# Altium schematic sheet ZH_ZP.SchDoc
size Tabloid
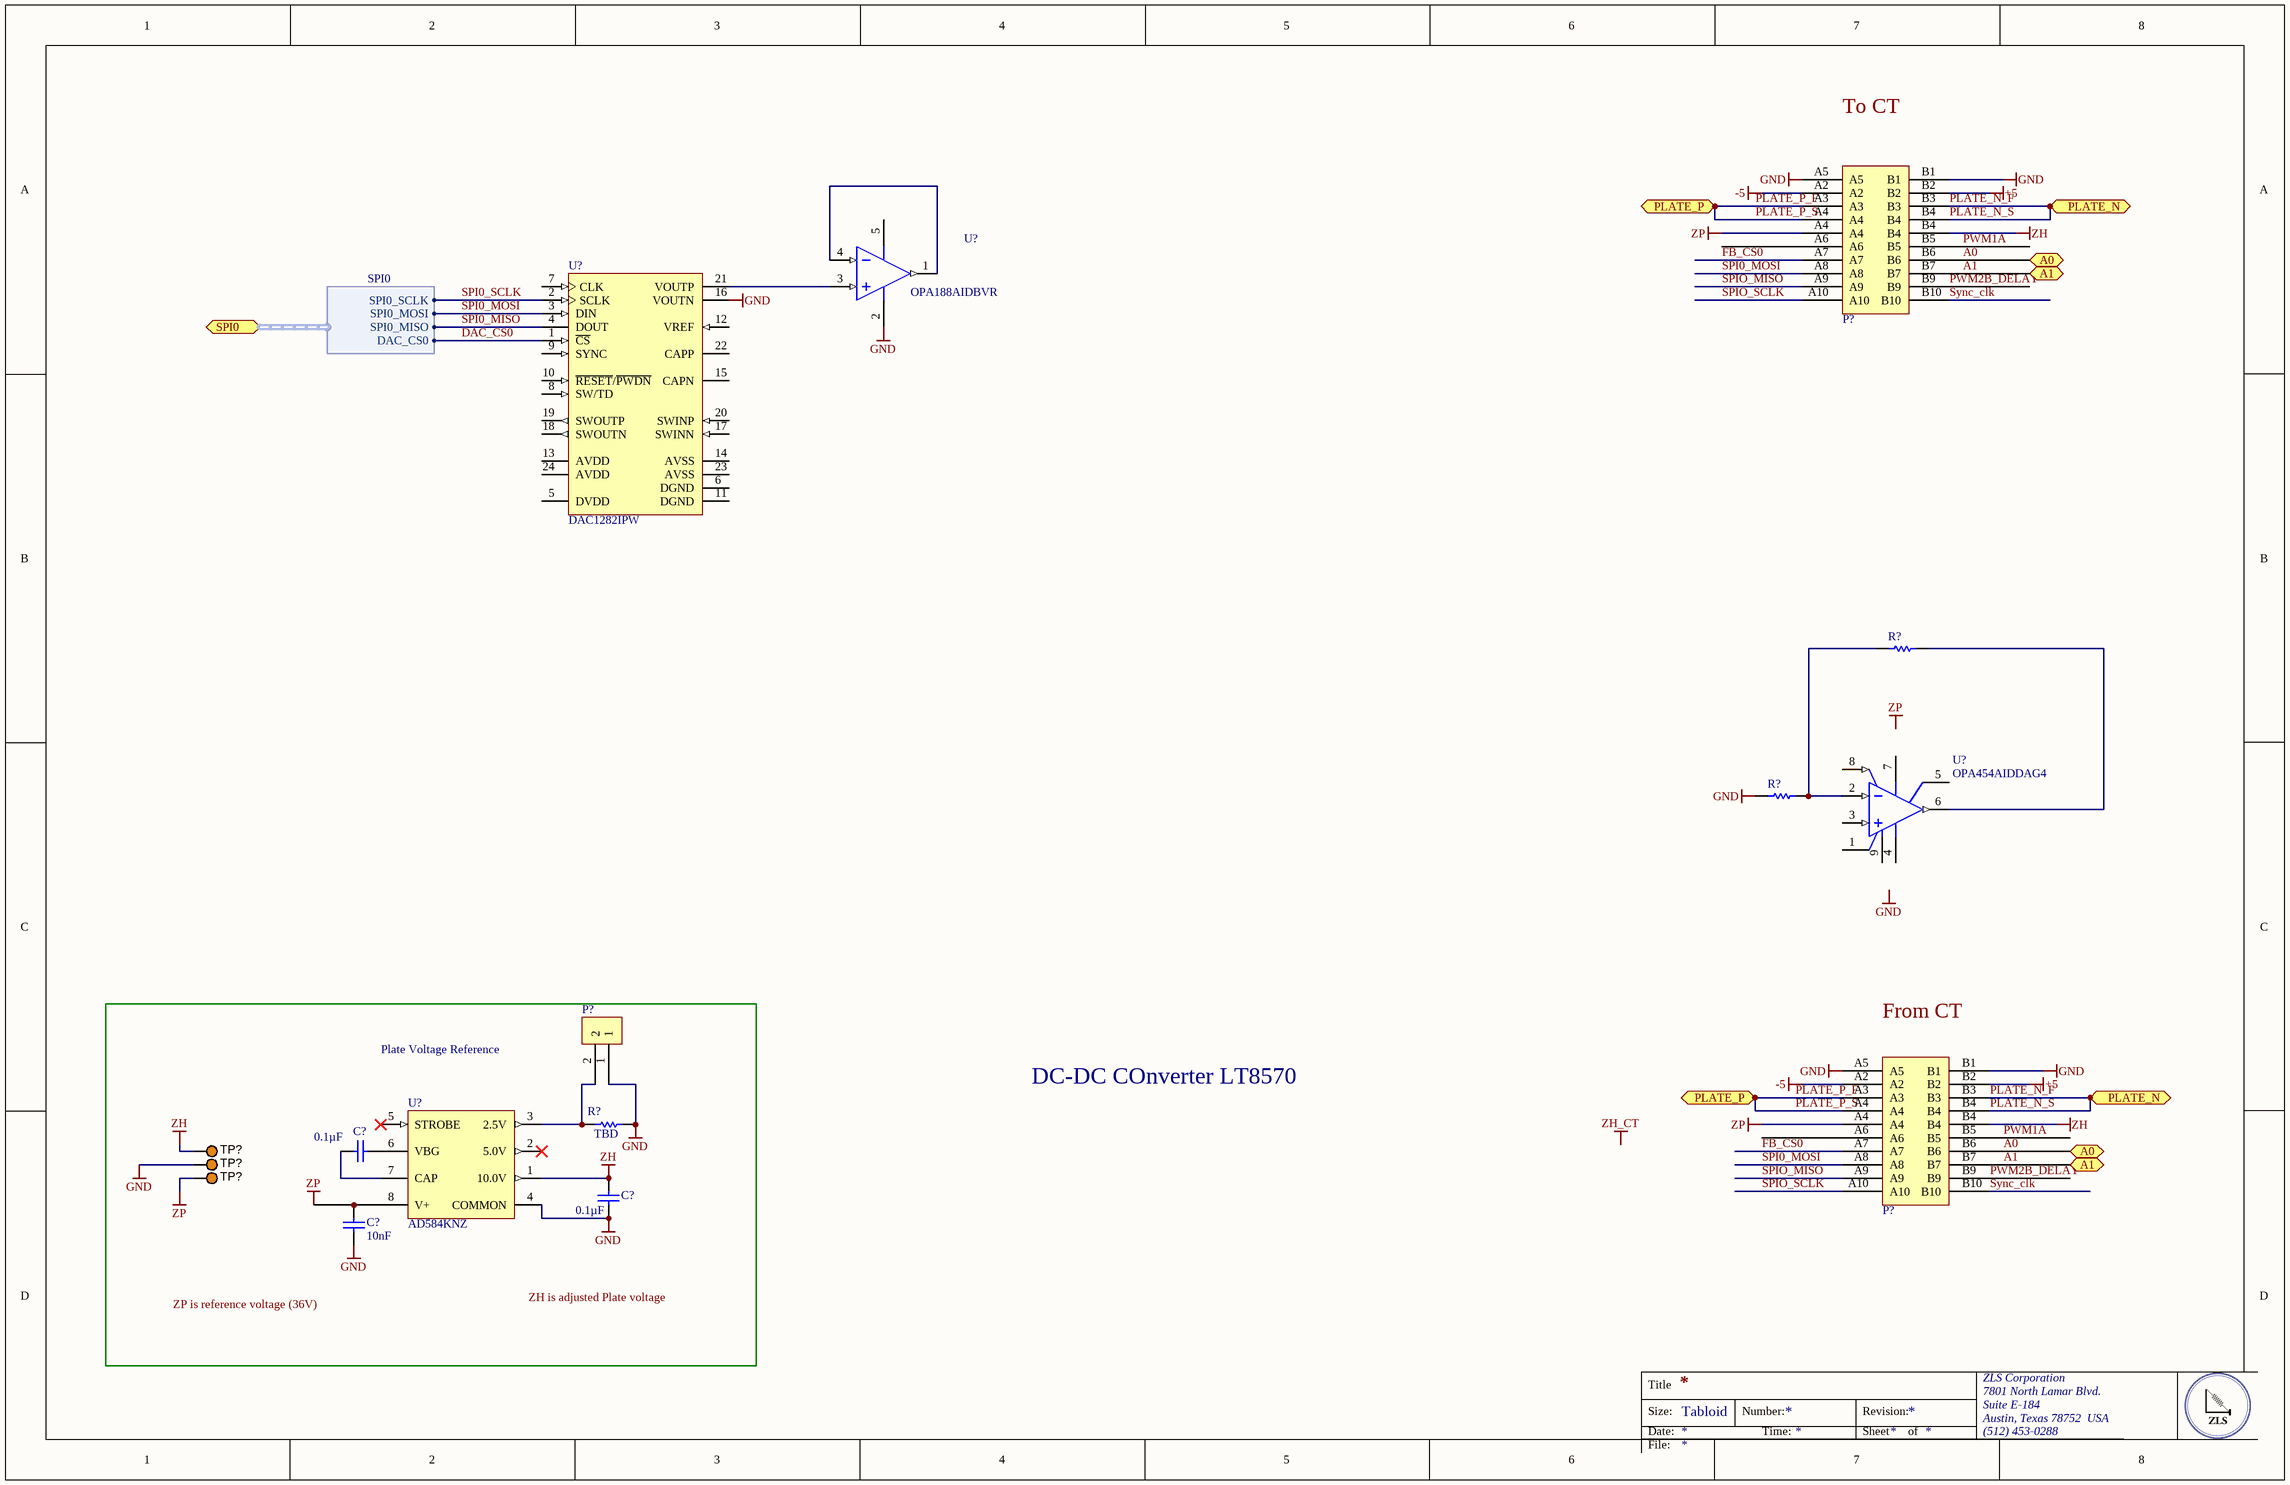
[diagram p0: ZH_ZP.SchDoc]

## Parts
(Parts that share a designator on the sheet are numbered #1, #2 ... from top to bottom, then left to right.)
C?#1  Capacitance: 0.1µF  [CAPC0805(2012)145_N]  (hidden comment: CAP CER 0.1UF 25V X7R 0805)
C?#2  Capacitance: 0.1µF  [CAPC0805(2012)145_N]  (hidden comment: CAP CER 0.1UF 25V X7R 0805)
C?#3  Capacitance: 10nF  [CAPC0805(2012)145_N]  (hidden comment: Multilayer Ceramic Capacitors MLCC - SMD/SMT 0.01uF 50volts 10% X7R)
P?#1  MEC6-110-0-PCB  [MEC6-110-02-L-DV]  (value not drawn)
P?#2  MEC6-110-0-PCB  [MEC6-110-02-L-DV]  (value not drawn)
P?#3  SSW-102-02-G-S-RA  [SSW-102-02-G-S-RA]  (value not drawn)
R?#1  (no value)  [RESC0402(1005)_M]
R?#2  (no value)  [RESC0402(1005)_M]
R?#3  TBD  [VH102K]
TP?#1  5003  [KSTN-5003]  (value not drawn)
TP?#2  5003  [KSTN-5003]  (value not drawn)
TP?#3  5003  [KSTN-5003]  (value not drawn)
U?#1  OPA188AIDBVR  [DBV0005A_M]
U?#2  DAC1282IPW  [TI-PW24_M]
U?#3  OPA454AIDDAG4  [TI-DDA8-2745X2245TP_N]
U?#4  AD584KNZ  [ADI-N-8]

## Blocks framed on the sheet
Plate Voltage Reference: C?#1-C?#3 P?#3 R?#3 TP?#1-TP?#3 U?#4

## Ports
A0, A1, PLATE_N, PLATE_P, SPI0 (harness SPI0)

## Harnesses
SPI0: DAC_CS0, SPI0_MOSI, SPI0_MISO, SPI0_SCLK

## Nets
+5: P?#1.B2 P?#2.B2
-5: P?#1.A2 P?#2.A2
GND: C?#2.2 C?#3.2 P?#1.A5 P?#1.B1 P?#2.A5 P?#2.B1 P?#3.1 R?#2.2 R?#3.2 TP?#2.1 U?#1.2(V-) U?#2.16(VOUTN) U?#4.4(COMMON)
ZH: C?#2.1 P?#1.B4 P?#2.B4 TP?#1.1 U?#4.1(10.0V)
ZP: C?#3.1 P?#1.A4 P?#2.A4 TP?#3.1 U?#4.8(V+)
A0: P?#1.B6 P?#2.B6 ; port A0
A1: P?#1.B7 P?#2.B7 ; port A1
DAC_CS0: U?#2.1(~{CS}) ; port SPI0.DAC_CS0
FB_CS0: P?#1.A7 P?#2.A7
PLATE_N_F: P?#1.B3 P?#1.B4 P?#2.B3 P?#2.B4 ; port PLATE_N  [also labelled PLATE_N_S]
PLATE_P_F: P?#1.A3 P?#1.A4 P?#2.A3 P?#2.A4 ; port PLATE_P  [also labelled PLATE_P_S]
PWM1A: P?#1.B5 P?#2.B5
PWM2B_DELAY: P?#1.B9 P?#2.B9
SPI0_MISO: U?#2.4(DOUT) ; port SPI0.SPI0_MISO
SPI0_MOSI: P?#1.A8 P?#2.A8 U?#2.3(DIN) ; port SPI0.SPI0_MOSI
SPI0_SCLK: U?#2.2(SCLK) ; port SPI0.SPI0_SCLK
SPIO_MISO: P?#1.A9 P?#2.A9
SPIO_SCLK: P?#1.A10 P?#2.A10
Sync_clk: P?#1.B10 P?#2.B10
NetC?#1_1: C?#1.1 U?#4.7(CAP)
NetC?#1_2: C?#1.2 U?#4.6(VBG)
NetP?#3_2: P?#3.2 R?#3.1 U?#4.3(2.5V)
NetR?#1_1: R?#1.1 U?#3.6(OUT)
NetR?#1_2: R?#1.2 R?#2.1 U?#3.2(IN-)
NetU?#1_1: U?#1.1(OUT) U?#1.4(IN-)
NetU?#1_3: U?#1.3(IN+) U?#2.21(VOUTP)

Not connected (* = marked no-connect by the designer): P?#1 A6; P?#2 A6; U?#1 5(V+); U?#2 5(DVDD) 6(DGND) 7(CLK) 8(SW/TD) 9(SYNC) 10(~{RESET}/~{PWDN}) 11(DGND) 12(VREF) 13(AVDD) 14(AVSS) 15(CAPN) 17(SWINN) 18(SWOUTN) 19(SWOUTP) 20(SWINP) 22(CAPP) 23(AVSS) 24(AVDD); U?#3 1(E/D_COM) 3(IN+) 4(V-) 5(STATUS_FLAG) 7(V+) 8(E/D) 9(EP); U?#4 2(5.0V)* 5(STROBE)*

## Notes on the sheet
- To CT
- (near P?#2) From CT
- DC-DC COnverter LT8570
- Labels drawn without touching a wire or pin: GND, ZH is adjusted Plate voltage, ZH_CT, ZP, ZP is reference voltage (36V)
- Title
- Size:
- Date:
- Tabloid
- Number:
- Time:
- Revision:
- Sheet
- of
- ZLS Corporation
- 7801 North Lamar Blvd.
- Suite E-184
- Austin, Texas 78752  USA
- (512) 453-0288
- File:

## Library data of the parts
C?#1 C?#2 = CMP-1036-04795-1: Manufacturer: Murata Electronics North America; Manufacturer Part Number: GRM21BR71E104KA01L; Tolerance: ±10%; Supplier 1: Digi-Key; Supplier Part Number 1: 490-1673-6-ND; RoHS: RoHS Compliant; Category: Capacitors; Stock 1: 891652; Pricing 1: 1=0.2, 10=0.145, 100=0.0683, 500=0.04788, 1000=0.03964 (USD); Packaging: Digi-Reel®; Part Status: Active; Voltage - Rated: 25V; Temperature Coefficient: X7R; Operating Temperature: -55°C ~ 125°C; Features: -; Ratings: -; Applications: General Purpose; Mounting Type: Surface Mount, MLCC; Package / Case: 0805 (2012 Metric); Size / Dimension: 0.079" L x 0.049" W (2.00mm x 1.25mm); Height - Seated (Max): -; Thickness (Max): 0.053" (1.35mm); Lead Spacing: -; Lead Style: -; ComponentLink1URL: http://www.murata.com/~/media/webrenewal/support/library/catalog/products/capacitor/mlcc/c02e.ashx; ComponentLink1Description: http://www.murata.com/~/media/webrenewal/support/library/catalog/products/capacitor/mlcc/c02e.ashx
C?#3 = CMP-1036-04795-1: Manufacturer: Kemet; Manufacturer Part Number: C0805C103K5RACAUTO; Voltage Rating: 50V; Supplier 1: Digi-Key; Supplier Part Number 1: 399-6924-1-ND; Stock 1: 63236; Pricing 1: 1=0.12, 10=0.087, 100=0.041, 500=0.0287, 1000=0.0238 (USD); Mount: Surface Mount; Case/Package: 0805; Case Code (Metric): 2012; Case Code (Imperial): 0805; Dielectric Material: Ceramic; Contact Plating: Tin; Min Operating Temperature: -55°C; Max Operating Temperature: 125°C; Tolerance: 10%; Packaging: Tape and Reel; Package Quantity: 1; Voltage Rating (DC): 50V; Dielectric: X7R; Termination: SMD/SMT; Length: 2mm; Height: 0.78mm; Width: 0.049inch; Thickness: 0.035inch; Depth: 1.25mm; Radiation Hardening: No; REACH SVHC: No SVHC; ComponentLink1URL: https://datasheet.ciiva.com/22700/1693454-22700519.pdf; ComponentLink1Description: https://datasheet.ciiva.com/22700/1693454-22700519.pdf; ComponentLink2URL: https://datasheet.ciiva.com/7842/1693454-7842175.pdf; ComponentLink2Description: https://datasheet.ciiva.com/7842/1693454-7842175.pdf
P?#3 = SSW-102-02-G-S-RA: CONN RCPT .100" 2POS R/A SGL AU; Manufacturer: Samtec Inc.; Connector Type: Receptacle; Style: Board to Board or Cable; Number of Positions: 2; Number of Positions Loaded: All; Pitch - Mating: 0.100" (2.54mm); Material Flammability Rating: UL94 V-0; Current Rating: 5.7A per Contact; Supplier 1: Digi-Key; Supplier Part Number 1: SAM1225-02-ND; Manufacturer Part Number: SSW-102-02-G-S-RA; RoHS: RoHS Compliant; Category: Connectors, Interconnects; Stock 1: 304; Pricing 1: 1=1.8, 10=1.607, 100=1.3234, 500=1.04614, 1000=0.89804, 5000=0.81926, 10000=0.78775 (USD); Packaging: Bulk; Part Status: Active; Contact Type: Forked; Row Spacing - Mating: -; Mounting Type: Through Hole, Right Angle; Termination: Solder; Fastening Type: Push-Pull; Contact Finish - Mating: Gold; Contact Finish Thickness - Mating: 20.0µin (0.51µm); Insulation Color: Black; Insulation Height: 0.095" (2.41mm); Contact Length - Post: 0.100" (2.54mm); Operating Temperature: -55°C ~ 125°C; Contact Finish - Post: Gold; Mated Stacking Heights: -; Ingress Protection: -; Features: -; Voltage Rating: -; Applications: -; Insulation Material: Liquid Crystal Polymer (LCP); Contact Shape: Square; Contact Material: Phosphor Bronze; Contact Finish Thickness - Post: 3.00µin (0.076µm); ComponentLink1URL: http://suddendocs.samtec.com/prints/ssw-1xx-xx-xxx-x-xx-xxx-xx-mkt.pdf; ComponentLink1Description: http://suddendocs.samtec.com/prints/ssw-1xx-xx-xxx-x-xx-xxx-xx-mkt.pdf
R?#1 R?#2 = CMP-1011-00463-1
R?#3 = CMP-1013-00393-1
TP?#1-TP?#3 = CMP-1672-00009-1: Test Point, Orange, 1-Pin THD, RoHS; Peak Reverse Current: 600 uA; Forward Current: 3 A; Max Surge Current: 80 A; Forward Voltage: 1.08 V; Max Operating Temperature: 150 degC; PackageReference: 5003; Pins: 2; ComponentLink2URL: http://keyelco.com/userAssets/file/M65p56.pdf; PackageDescription: 1-Pin Through Hole Device, Dia 2.54 mm; Weight: 0.01 lb; Diameter: 5.3 mm; Mount: Through Hole; Package Quantity: 500; Packaging: Bulk; Min Operating Temperature: -65 degC; ComponentLink1Description: Manufacturer URL; Height: 0.25 inch; ComponentLink1URL: http://www.keyelco.com/; ComponentLink2Description: Datasheet; Width: 0.25 inch; REACH SVHC: No SVHC; RoHSCompliant: true; Radiation Hardening: No; Length: 9.5 mm; DatasheetVersion: Jun-15
U?#1 = CMP-0809-00005-2: Precision, Low Noise, Rail-to-Rail Output, Zero-Drift Operational Amplifier, 4 to 36 V, -40 to 125 degC, 5-pin SOT23 (DBV5), Green (RoHS & no Sb/Br); Manufacturer: Texas Instruments; Total Supply Voltage(Min)(+5V is 5, +/-5V is 10): 4; Offset Drift(Typ)(uV/C): 0.03; Rating: Catalog; SubFamily: Zero Drift Precision Amplifier; GBW(Typ)(MHz): 2; Slew Rate(Typ)(V/us): 0.8; Number of Channels: 1; CMRR(Min)(dB): 120; Iq per channel(Max)(mA): 0.51; Total Supply Voltage(Max)(+5V is 5, +/-5V is 10): 36; PartNumber: OPA188AIDBVR; ComponentLink2Description: Datasheet; ComponentLink2URL: http://www.ti.com/lit/ds/symlink/opa188.pdf; ComponentLink1Description: Manufacturer URL; Mounting Technology: Surface Mount; Eco-Plan: Green (RoHS & no Sb/Br); ComponentLink1URL: http://www.ti.com/; PackageVersion: 4073253-4/K, 03/2006; DatasheetVersion: SBOS642A; ComponentLink3Description: Package Specification; PackageReference: DBV0005A; ComponentLink3URL: http://www.ti.com/litv/pdf/mpds018i; PackageDescription: 5-Pin Plastic Small Outline, Body 1.6 x 2.9 mm, Pitch 0.95 mm; Code_JEDEC: MO-178
U?#2 = CMP-0004-01365-1: Low Distortion DAC for Seismic Application, -40 to 85 degC, 24-pin SOP (PW24), Green (RoHS & no Sb/Br); Manufacturer: Texas Instruments; Settling Time(us): 25; SubFamily: Precision DAC (=<10MSPS); DAC Channels: 1; Interface: Serial SPI; Power Consumption(Typ)(mW): 38; SNR(dB): 120; Code_JEDEC: MO-153; PackageDescription: 24-Pin Plastic Small Outline, Body 7.8 x 4.4 mm, Pitch 0.65 mm; ComponentLink3URL: http://www.ti.com/litv/pdf/mpds363; ComponentLink2Description: Datasheet; PackageVersion: 4040064-6/G, 02/2011; PartNumber: DAC1282IPW; PackageReference: PW24; ComponentLink2URL: http://www.ti.com/general/docs/lit/getliterature.tsp?genericPartNumber=DAC1282&fileType=pdf; ComponentLink3Description: Package Specification; DatasheetVersion: SBAS490A; Mounting Technology: Surface Mount; ComponentLink1Description: Manufacturer URL; Eco-Plan: Green (RoHS & no Sb/Br); ComponentLink1URL: http://www.ti.com/
U?#3 = CMP-0017-00715-1: High Voltage (100V), High-Current (50mA) Operational Amplifier, G=1 Stable, 10 to 100 V, -55 to 125 degC, 8-pin SOP (DDA8), Green (RoHS & no Sb/Br); Manufacturer: Texas Instruments; Sub Family: General Purpose Amplifier, High Output Current Amplifier (>=50mA), High Supply Voltage Amplifier (>=30V), Precision Amplifier; Offset Drift(Typ)(uV/C): 1.6; Slew Rate(Typ)(V/us): 13; Number of Channels: 1; Total Supply Voltage(Max)(+5V is 5, +/-5V is 10): 100; Total Supply Voltage(Min)(+5V is 5, +/-5V is 10): 10; Vio (25C)(Max)(mV): 4; GBW(Typ)(MHz): 2.5; Vn at 1kHz(Typ)(nV/rtHz): 47; Rating: Catalog; ComponentLink1URL: http://www.ti.com/; PartNumber: OPA454AIDDAG4; ComponentLink1Description: Manufacturer URL; Eco-Plan: Green (RoHS & no Sb/Br); ComponentLink3URL: http://www.ti.com/litv/pdf/mpds092e; IIB(Max)(pA): 100; ComponentLink2URL: http://www.ti.com/lit/ds/symlink/opa454.pdf; ComponentLink3Description: Package Specification; DatasheetVersion: SBOS391A; Iq per channel(Max)(mA): 4; PackageVersion: 4202561/F, 12/2011; Code_JEDEC: MS-012; CMRR(Min)(dB): 100; PackageReference: DDA8-2745X2245TP; Mounting Technology: Surface Mount; ComponentLink2Description: Datasheet; PackageDescription: 8-Pin PowerPAD(TM) Plastic Small Outline, Body 3.9 x 4.9 mm, Pitch 1.27 mm
U?#4 = CMP-0784-00054-1: Pin Programmable, Precision Voltage Reference, + 2.5 / + 5 / + 7.5 / + 10 Prog V Output, 4.5 to 30 V Supply, Commercial, 8-pin DIP (N-8), Tube; Manufacturer: Analog Devices Inc.; Reference Type: Series; Voltage - Output (Min/Fixed): 2.5V, 5V, 7.5V, 10V; Tolerance: ±0.1%; Temperature Coefficient: 15ppm/°C; Noise - 0.1Hz to 10Hz: 50µVp-p; Voltage - Input: 4.5 V ~ 30 V; Current - Supply: 1mA; Supplier 1: Digi-Key; Supplier Part Number 1: AD584KNZ-ND; Manufacturer Part Number: AD584KNZ; RoHS: RoHS Compliant; Category: Integrated Circuits (ICs); Stock 1: 387; Pricing 1: 1=17.64, 50=15.54, 100=13.692 (USD); Packaging: Tube; Part Status: Active; Output Type: Programmable; Noise - 10Hz to 10kHz: -; Operating Temperature: 0°C ~ 70°C (TA); Mounting Type: Through Hole; Package / Case: 8-DIP (0.300", 7.62mm); Supplier Device Package: 8-PDIP; Base Part Number: AD584; ComponentLink1URL: http://www.analog.com/media/en/technical-documentation/data-sheets/AD584.pdf; ComponentLink1Description: http://www.analog.com/media/en/technical-documentation/data-sheets/AD584.pdf